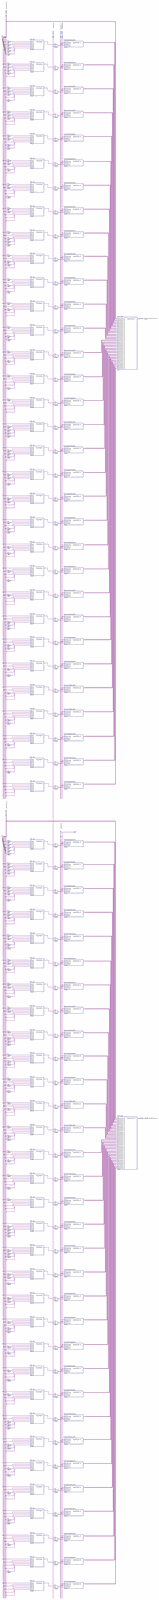
[diagram p0: schematic sheet, whole]
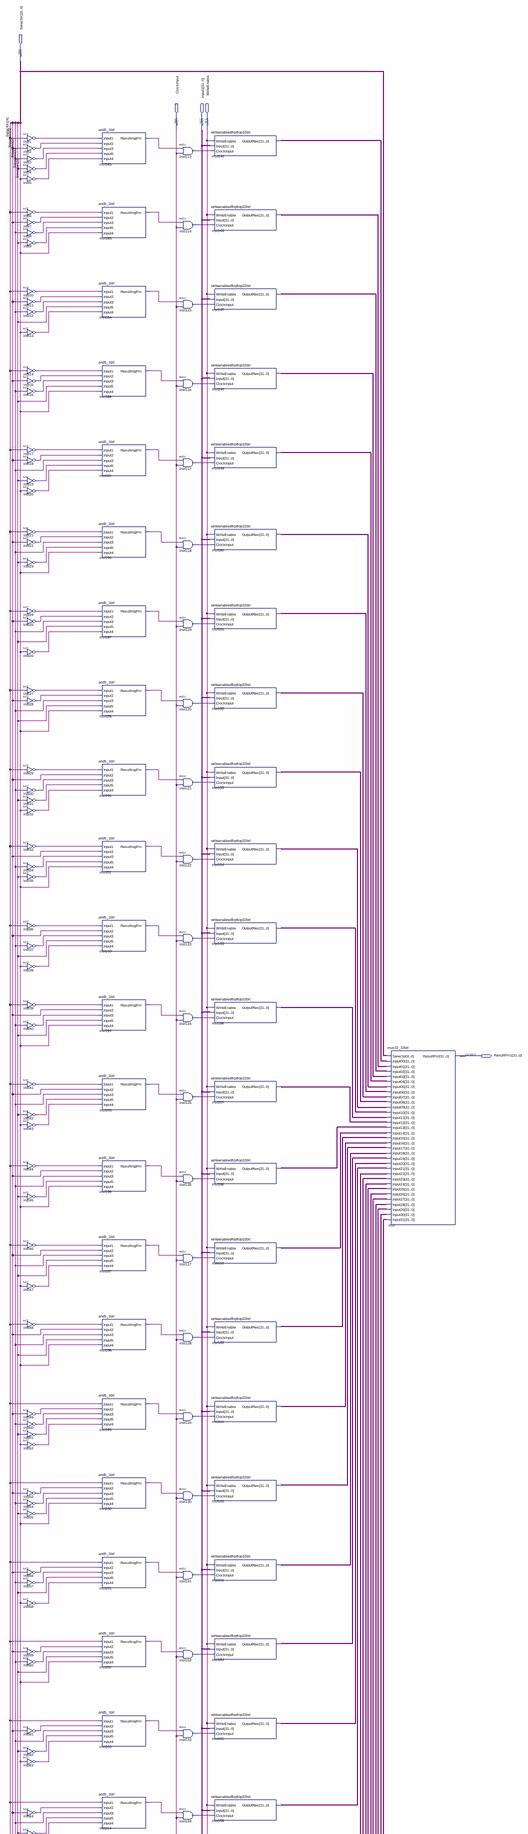
[diagram p1: schematic sheet, upper part]
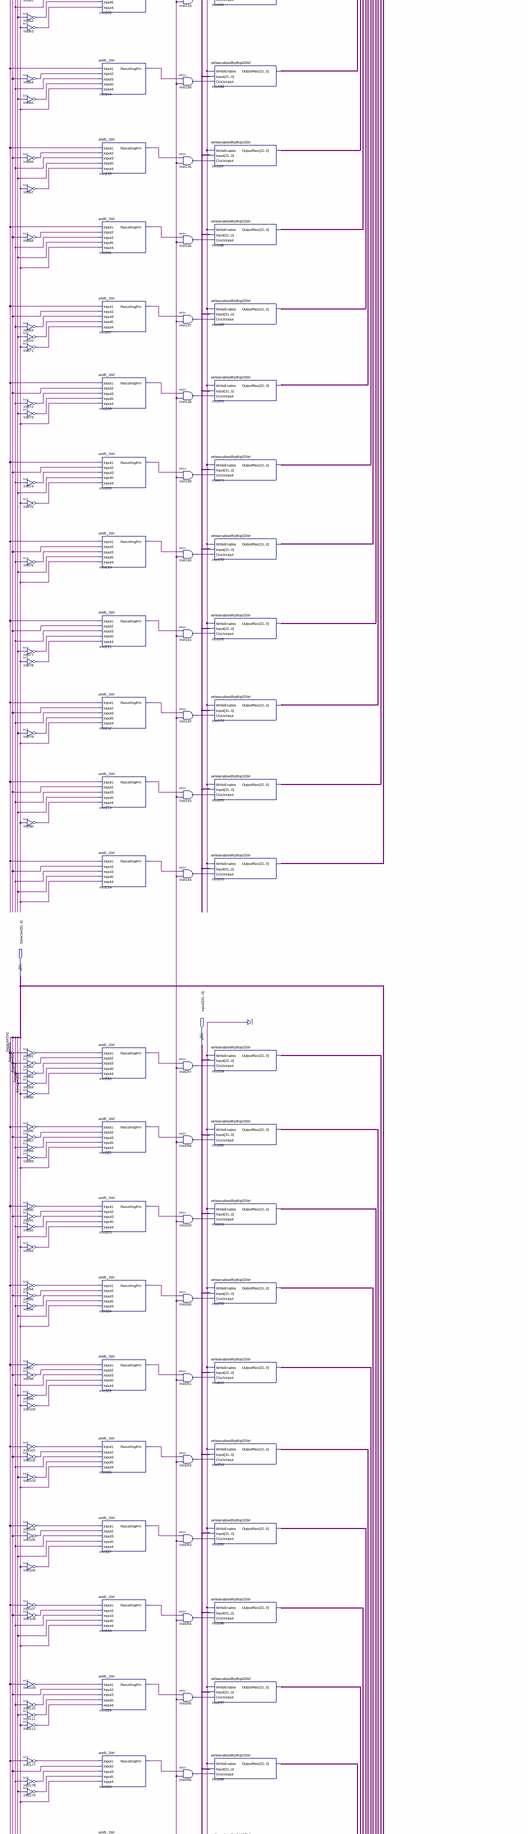
[diagram p2: schematic sheet, middle part]
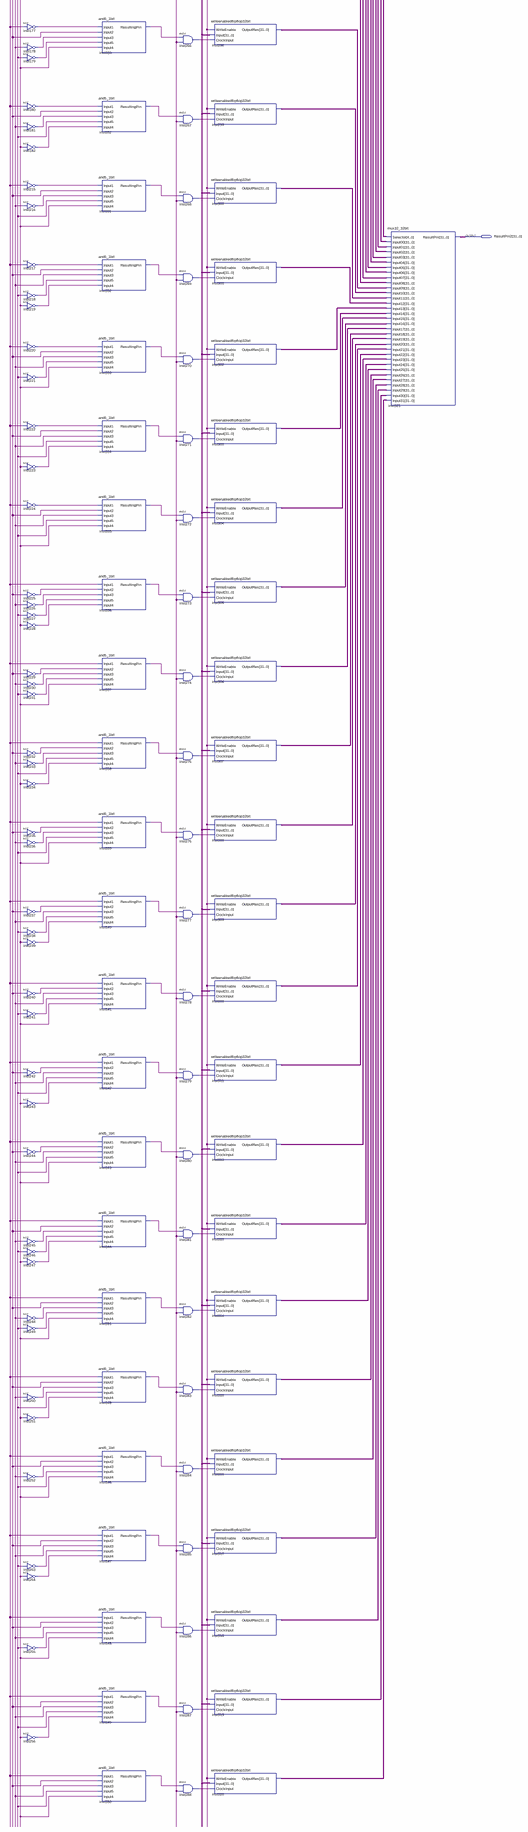
[diagram p3: schematic sheet, lower part]
// Quartus schematic 32writeenabledflipflop32bit2input.bdf as structural Verilog: 354 symbols, 8 pins
module \32writeenabledflipflop32bit2input  (
  input  [0:4] Selector1,
  input  ClockInput,
  input  [31:0] Input1,
  input  WriteEnable,
  input  [0:4] Selector2,
  input  [31:0] Input2,
  output [31:0] ResultPin1,
  output [31:0] ResultPin2
);

  wire inst1_out, inst2_out, inst3_out, inst4_out, inst5_out, inst6_out, inst7_out, inst8_out, inst9_out,
       inst10_out, inst11_out, inst12_out, inst13_out, inst14_out, inst15_out, inst16_out, inst17_out,
       inst18_out, inst19_out, inst20_out, inst21_out, inst22_out, inst23_out, inst24_out, inst25_out,
       inst26_out, inst27_out, inst28_out, inst29_out, inst30_out, inst31_out, inst32_out, inst33_out,
       inst34_out, inst35_out, inst36_out, inst37_out, inst38_out, inst39_out, inst40_out, inst41_out,
       inst42_out, inst43_out, inst44_out, inst45_out, inst46_out, inst47_out, inst48_out, inst49_out,
       inst50_out, inst51_out, inst52_out, inst53_out, inst54_out, inst55_out, inst56_out, inst57_out,
       inst58_out, inst59_out, inst60_out, inst61_out, inst62_out, inst63_out, inst64_out, inst65_out,
       inst66_out, inst67_out, inst68_out, inst69_out, inst70_out, inst71_out, inst72_out, inst73_out,
       inst74_out, inst75_out, inst76_out, inst77_out, inst78_out, inst79_out, inst80_out, inst81_out,
       inst82_out, inst83_out, inst84_out, inst85_out, inst86_out, inst87_out, inst88_out, inst89_out,
       inst90_out, inst91_out, inst92_out, inst93_out, inst94_out, inst95_out, inst96_out, inst97_out,
       inst98_out, inst99_out, inst100_out, inst101_out, inst102_out, inst103_out, inst104_out, inst105_out,
       inst106_out, inst107_out, inst108_out, inst109_out, inst110_out, inst111_out, inst112_out,
       inst113_out, inst114_out, inst115_out, inst116_out, inst117_out, inst118_out, inst119_out,
       inst120_out, inst121_out, inst122_out, inst123_out, inst124_out, inst125_out, inst126_out,
       inst127_out, inst128_out, inst129_out, inst130_out, inst131_out, inst132_out, inst133_out,
       inst134_out, inst135_out, inst136_out, inst137_out, inst138_out, inst139_out, inst140_out,
       inst141_out, inst142_out, inst143_out, inst144_out, inst177_out, inst178_out, inst179_out,
       inst180_out, inst181_out, inst182_out, inst183_resultingpin, inst184_resultingpin,
       inst185_resultingpin, inst186_resultingpin, inst187_resultingpin, inst188_resultingpin,
       inst189_resultingpin, inst190_resultingpin, inst191_resultingpin, inst192_resultingpin,
       inst193_resultingpin, inst194_resultingpin, inst195_resultingpin, inst196_resultingpin,
       inst197_resultingpin, inst198_resultingpin, inst199_resultingpin, inst200_resultingpin,
       inst201_resultingpin, inst202_resultingpin, inst203_resultingpin, inst204_resultingpin,
       inst205_resultingpin, inst206_resultingpin, inst207_resultingpin, inst208_resultingpin,
       inst209_resultingpin, inst210_resultingpin, inst211_resultingpin, inst212_resultingpin,
       inst213_resultingpin, inst214_resultingpin, inst215_out, inst216_out, inst217_out, inst218_out,
       inst219_out, inst220_out, inst221_out, inst222_out, inst223_out, inst224_out, inst225_out,
       inst226_out, inst227_out, inst228_out, inst229_out, inst230_out, inst231_out, inst232_out,
       inst233_out, inst234_out, inst235_out, inst236_out, inst237_out, inst238_out, inst239_out,
       inst240_out, inst241_out, inst242_out, inst243_out, inst244_out, inst245_out, inst246_out,
       inst247_out, inst248_out, inst249_out, inst250_out, inst251_out, inst252_out, inst253_out,
       inst254_out, inst255_out, inst256_out, inst257_out, inst258_out, inst259_out, inst260_out,
       inst261_out, inst262_out, inst263_out, inst264_out, inst265_out, inst266_out, inst267_out,
       inst268_out, inst269_out, inst270_out, inst271_out, inst272_out, inst273_out, inst274_out,
       inst275_out, inst276_out, inst277_out, inst278_out, inst279_out, inst280_out, inst281_out,
       inst282_out, inst283_out, inst284_out, inst285_out, inst286_out, inst287_out, inst288_out,
       inst322_resultingpin, inst323_resultingpin, inst324_resultingpin, inst325_resultingpin,
       inst326_resultingpin, inst327_resultingpin, inst328_resultingpin, inst329_resultingpin,
       inst330_resultingpin, inst331_resultingpin, inst332_resultingpin, inst333_resultingpin,
       inst334_resultingpin, inst335_resultingpin, inst336_resultingpin, inst337_resultingpin,
       inst338_resultingpin, inst339_resultingpin, inst340_resultingpin, inst341_resultingpin,
       inst342_resultingpin, inst343_resultingpin, inst344_resultingpin, inst345_resultingpin,
       inst346_resultingpin, inst347_resultingpin, inst348_resultingpin, inst349_resultingpin,
       inst350_resultingpin, inst351_resultingpin, inst352_resultingpin, inst353_resultingpin;
  wire [31:0] inst145_outputres, inst146_outputres, inst147_outputres, inst148_outputres, inst149_outputres,
       inst150_outputres, inst151_outputres, inst152_outputres, inst153_outputres, inst154_outputres,
       inst155_outputres, inst156_outputres, inst157_outputres, inst158_outputres, inst159_outputres,
       inst160_outputres, inst161_outputres, inst162_outputres, inst163_outputres, inst164_outputres,
       inst165_outputres, inst166_outputres, inst167_outputres, inst168_outputres, inst169_outputres,
       inst170_outputres, inst171_outputres, inst172_outputres, inst173_outputres, inst174_outputres,
       inst175_outputres, inst176_outputres, inst289_outputres, inst290_outputres, inst291_outputres,
       inst292_outputres, inst293_outputres, inst294_outputres, inst295_outputres, inst296_outputres,
       inst297_outputres, inst298_outputres, inst299_outputres, inst300_outputres, inst301_outputres,
       inst302_outputres, inst303_outputres, inst304_outputres, inst305_outputres, inst306_outputres,
       inst307_outputres, inst308_outputres, inst309_outputres, inst310_outputres, inst311_outputres,
       inst312_outputres, inst313_outputres, inst314_outputres, inst315_outputres, inst316_outputres,
       inst317_outputres, inst318_outputres, inst319_outputres, inst320_outputres;

  not inst1 (inst1_out, Selector1[4]);
  not inst2 (inst2_out, Selector1[3]);
  not inst3 (inst3_out, Selector1[2]);
  not inst4 (inst4_out, Selector1[1]);
  not inst5 (inst5_out, Selector1[0]);
  not inst6 (inst6_out, Selector1[4]);
  not inst7 (inst7_out, Selector1[3]);
  not inst8 (inst8_out, Selector1[2]);
  not inst9 (inst9_out, Selector1[1]);
  not inst10 (inst10_out, Selector1[4]);
  not inst11 (inst11_out, Selector1[3]);
  not inst12 (inst12_out, Selector1[2]);
  not inst13 (inst13_out, Selector1[0]);
  not inst14 (inst14_out, Selector1[4]);
  not inst15 (inst15_out, Selector1[3]);
  not inst16 (inst16_out, Selector1[2]);
  not inst17 (inst17_out, Selector1[4]);
  not inst18 (inst18_out, Selector1[3]);
  not inst19 (inst19_out, Selector1[1]);
  not inst20 (inst20_out, Selector1[0]);
  not inst21 (inst21_out, Selector1[4]);
  not inst22 (inst22_out, Selector1[3]);
  not inst23 (inst23_out, Selector1[1]);
  not inst24 (inst24_out, Selector1[4]);
  not inst25 (inst25_out, Selector1[3]);
  not inst26 (inst26_out, Selector1[0]);
  not inst27 (inst27_out, Selector1[4]);
  not inst28 (inst28_out, Selector1[3]);
  not inst29 (inst29_out, Selector1[4]);
  not inst30 (inst30_out, Selector1[2]);
  not inst31 (inst31_out, Selector1[1]);
  not inst32 (inst32_out, Selector1[0]);
  not inst33 (inst33_out, Selector1[4]);
  not inst34 (inst34_out, Selector1[2]);
  not inst35 (inst35_out, Selector1[1]);
  not inst36 (inst36_out, Selector1[4]);
  not inst37 (inst37_out, Selector1[2]);
  not inst38 (inst38_out, Selector1[0]);
  not inst39 (inst39_out, Selector1[4]);
  not inst40 (inst40_out, Selector1[2]);
  not inst41 (inst41_out, Selector1[4]);
  not inst42 (inst42_out, Selector1[1]);
  not inst43 (inst43_out, Selector1[0]);
  not inst44 (inst44_out, Selector1[4]);
  not inst45 (inst45_out, Selector1[1]);
  not inst46 (inst46_out, Selector1[4]);
  not inst47 (inst47_out, Selector1[0]);
  not inst48 (inst48_out, Selector1[4]);
  not inst49 (inst49_out, Selector1[3]);
  not inst50 (inst50_out, Selector1[2]);
  not inst51 (inst51_out, Selector1[1]);
  not inst52 (inst52_out, Selector1[0]);
  not inst53 (inst53_out, Selector1[3]);
  not inst54 (inst54_out, Selector1[2]);
  not inst55 (inst55_out, Selector1[1]);
  not inst56 (inst56_out, Selector1[3]);
  not inst57 (inst57_out, Selector1[2]);
  not inst58 (inst58_out, Selector1[0]);
  not inst59 (inst59_out, Selector1[3]);
  not inst60 (inst60_out, Selector1[2]);
  not inst61 (inst61_out, Selector1[3]);
  not inst62 (inst62_out, Selector1[1]);
  not inst63 (inst63_out, Selector1[0]);
  not inst64 (inst64_out, Selector1[3]);
  not inst65 (inst65_out, Selector1[1]);
  not inst66 (inst66_out, Selector1[3]);
  not inst67 (inst67_out, Selector1[0]);
  not inst68 (inst68_out, Selector1[3]);
  not inst69 (inst69_out, Selector1[2]);
  not inst70 (inst70_out, Selector1[1]);
  not inst71 (inst71_out, Selector1[0]);
  not inst72 (inst72_out, Selector1[2]);
  not inst73 (inst73_out, Selector1[1]);
  not inst74 (inst74_out, Selector1[2]);
  not inst75 (inst75_out, Selector1[0]);
  not inst76 (inst76_out, Selector1[2]);
  not inst77 (inst77_out, Selector1[1]);
  not inst78 (inst78_out, Selector1[0]);
  not inst79 (inst79_out, Selector1[1]);
  not inst80 (inst80_out, Selector1[0]);
  not inst81 (inst81_out, Selector2[4]);
  not inst82 (inst82_out, Selector2[3]);
  not inst83 (inst83_out, Selector2[2]);
  not inst84 (inst84_out, Selector2[1]);
  not inst85 (inst85_out, Selector2[0]);
  not inst86 (inst86_out, Selector2[4]);
  not inst87 (inst87_out, Selector2[3]);
  not inst88 (inst88_out, Selector2[2]);
  not inst89 (inst89_out, Selector2[1]);
  not inst90 (inst90_out, Selector2[4]);
  not inst91 (inst91_out, Selector2[3]);
  not inst92 (inst92_out, Selector2[2]);
  not inst93 (inst93_out, Selector2[0]);
  not inst94 (inst94_out, Selector2[4]);
  not inst95 (inst95_out, Selector2[3]);
  not inst96 (inst96_out, Selector2[2]);
  not inst97 (inst97_out, Selector2[4]);
  not inst98 (inst98_out, Selector2[3]);
  not inst99 (inst99_out, Selector2[1]);
  not inst100 (inst100_out, Selector2[0]);
  not inst101 (inst101_out, Selector2[4]);
  not inst102 (inst102_out, Selector2[3]);
  not inst103 (inst103_out, Selector2[1]);
  not inst104 (inst104_out, Selector2[4]);
  not inst105 (inst105_out, Selector2[3]);
  not inst106 (inst106_out, Selector2[0]);
  not inst107 (inst107_out, Selector2[4]);
  not inst108 (inst108_out, Selector2[3]);
  not inst109 (inst109_out, Selector2[4]);
  not inst110 (inst110_out, Selector2[2]);
  not inst111 (inst111_out, Selector2[1]);
  not inst112 (inst112_out, Selector2[0]);
  not inst177 (inst177_out, Selector2[4]);
  not inst178 (inst178_out, Selector2[2]);
  not inst179 (inst179_out, Selector2[1]);
  not inst180 (inst180_out, Selector2[4]);
  not inst181 (inst181_out, Selector2[2]);
  not inst182 (inst182_out, Selector2[0]);
  not inst215 (inst215_out, Selector2[4]);
  not inst216 (inst216_out, Selector2[2]);
  not inst217 (inst217_out, Selector2[4]);
  not inst218 (inst218_out, Selector2[1]);
  not inst219 (inst219_out, Selector2[0]);
  not inst220 (inst220_out, Selector2[4]);
  not inst221 (inst221_out, Selector2[1]);
  not inst222 (inst222_out, Selector2[4]);
  not inst223 (inst223_out, Selector2[0]);
  not inst224 (inst224_out, Selector2[4]);
  not inst225 (inst225_out, Selector2[3]);
  not inst226 (inst226_out, Selector2[2]);
  not inst227 (inst227_out, Selector2[1]);
  not inst228 (inst228_out, Selector2[0]);
  not inst229 (inst229_out, Selector2[3]);
  not inst230 (inst230_out, Selector2[2]);
  not inst231 (inst231_out, Selector2[1]);
  not inst232 (inst232_out, Selector2[3]);
  not inst233 (inst233_out, Selector2[2]);
  not inst234 (inst234_out, Selector2[0]);
  not inst235 (inst235_out, Selector2[3]);
  not inst236 (inst236_out, Selector2[2]);
  not inst237 (inst237_out, Selector2[3]);
  not inst238 (inst238_out, Selector2[1]);
  not inst239 (inst239_out, Selector2[0]);
  not inst240 (inst240_out, Selector2[3]);
  not inst241 (inst241_out, Selector2[1]);
  not inst242 (inst242_out, Selector2[3]);
  not inst243 (inst243_out, Selector2[0]);
  not inst244 (inst244_out, Selector2[3]);
  not inst245 (inst245_out, Selector2[2]);
  not inst246 (inst246_out, Selector2[1]);
  not inst247 (inst247_out, Selector2[0]);
  not inst248 (inst248_out, Selector2[2]);
  not inst249 (inst249_out, Selector2[1]);
  not inst250 (inst250_out, Selector2[2]);
  not inst251 (inst251_out, Selector2[0]);
  not inst252 (inst252_out, Selector2[2]);
  not inst253 (inst253_out, Selector2[1]);
  not inst254 (inst254_out, Selector2[0]);
  not inst255 (inst255_out, Selector2[1]);
  not inst256 (inst256_out, Selector2[0]);
  and5_1bit inst185 (
    .Input1(inst1_out), .Input2(inst2_out), .Input3(inst3_out), .Input5(inst4_out), .Input4(inst5_out),
    .ResultingPin(inst185_resultingpin));
  and5_1bit inst183 (
    .Input1(inst6_out), .Input2(inst7_out), .Input3(inst8_out), .Input5(inst9_out), .Input4(Selector1[0]),
    .ResultingPin(inst183_resultingpin));
  and5_1bit inst184 (
    .Input1(inst10_out), .Input2(inst11_out), .Input3(inst12_out), .Input5(Selector1[1]),
    .Input4(inst13_out), .ResultingPin(inst184_resultingpin));
  and5_1bit inst186 (
    .Input1(inst14_out), .Input2(inst15_out), .Input3(inst16_out), .Input5(Selector1[1]),
    .Input4(Selector1[0]), .ResultingPin(inst186_resultingpin));
  and5_1bit inst189 (
    .Input1(inst17_out), .Input2(inst18_out), .Input3(Selector1[2]), .Input5(inst19_out),
    .Input4(inst20_out), .ResultingPin(inst189_resultingpin));
  and5_1bit inst190 (
    .Input1(inst21_out), .Input2(inst22_out), .Input3(Selector1[2]), .Input5(inst23_out),
    .Input4(Selector1[0]), .ResultingPin(inst190_resultingpin));
  and5_1bit inst187 (
    .Input1(inst24_out), .Input2(inst25_out), .Input3(Selector1[2]), .Input5(Selector1[1]),
    .Input4(inst26_out), .ResultingPin(inst187_resultingpin));
  and5_1bit inst188 (
    .Input1(inst27_out), .Input2(inst28_out), .Input3(Selector1[2]), .Input5(Selector1[1]),
    .Input4(Selector1[0]), .ResultingPin(inst188_resultingpin));
  and5_1bit inst191 (
    .Input1(inst29_out), .Input2(Selector1[3]), .Input3(inst30_out), .Input5(inst31_out),
    .Input4(inst32_out), .ResultingPin(inst191_resultingpin));
  and5_1bit inst192 (
    .Input1(inst33_out), .Input2(Selector1[3]), .Input3(inst34_out), .Input5(inst35_out),
    .Input4(Selector1[0]), .ResultingPin(inst192_resultingpin));
  and5_1bit inst193 (
    .Input1(inst36_out), .Input2(Selector1[3]), .Input3(inst37_out), .Input5(Selector1[1]),
    .Input4(inst38_out), .ResultingPin(inst193_resultingpin));
  and5_1bit inst194 (
    .Input1(inst39_out), .Input2(Selector1[3]), .Input3(inst40_out), .Input5(Selector1[1]),
    .Input4(Selector1[0]), .ResultingPin(inst194_resultingpin));
  and5_1bit inst195 (
    .Input1(inst41_out), .Input2(Selector1[3]), .Input3(Selector1[2]), .Input5(inst42_out),
    .Input4(inst43_out), .ResultingPin(inst195_resultingpin));
  and5_1bit inst196 (
    .Input1(inst44_out), .Input2(Selector1[3]), .Input3(Selector1[2]), .Input5(inst45_out),
    .Input4(Selector1[0]), .ResultingPin(inst196_resultingpin));
  and5_1bit inst197 (
    .Input1(inst46_out), .Input2(Selector1[3]), .Input3(Selector1[2]), .Input5(Selector1[1]),
    .Input4(inst47_out), .ResultingPin(inst197_resultingpin));
  and5_1bit inst198 (
    .Input1(inst48_out), .Input2(Selector1[3]), .Input3(Selector1[2]), .Input5(Selector1[1]),
    .Input4(Selector1[0]), .ResultingPin(inst198_resultingpin));
  and5_1bit inst199 (
    .Input1(Selector1[4]), .Input2(inst49_out), .Input3(inst50_out), .Input5(inst51_out),
    .Input4(inst52_out), .ResultingPin(inst199_resultingpin));
  and5_1bit inst200 (
    .Input1(Selector1[4]), .Input2(inst53_out), .Input3(inst54_out), .Input5(inst55_out),
    .Input4(Selector1[0]), .ResultingPin(inst200_resultingpin));
  and5_1bit inst201 (
    .Input1(Selector1[4]), .Input2(inst56_out), .Input3(inst57_out), .Input5(Selector1[1]),
    .Input4(inst58_out), .ResultingPin(inst201_resultingpin));
  and5_1bit inst202 (
    .Input1(Selector1[4]), .Input2(inst59_out), .Input3(inst60_out), .Input5(Selector1[1]),
    .Input4(Selector1[0]), .ResultingPin(inst202_resultingpin));
  and5_1bit inst203 (
    .Input1(Selector1[4]), .Input2(inst61_out), .Input3(Selector1[2]), .Input5(inst62_out),
    .Input4(inst63_out), .ResultingPin(inst203_resultingpin));
  and5_1bit inst204 (
    .Input1(Selector1[4]), .Input2(inst64_out), .Input3(Selector1[2]), .Input5(inst65_out),
    .Input4(Selector1[0]), .ResultingPin(inst204_resultingpin));
  and5_1bit inst205 (
    .Input1(Selector1[4]), .Input2(inst66_out), .Input3(Selector1[2]), .Input5(Selector1[1]),
    .Input4(inst67_out), .ResultingPin(inst205_resultingpin));
  and5_1bit inst206 (
    .Input1(Selector1[4]), .Input2(inst68_out), .Input3(Selector1[2]), .Input5(Selector1[1]),
    .Input4(Selector1[0]), .ResultingPin(inst206_resultingpin));
  and5_1bit inst207 (
    .Input1(Selector1[4]), .Input2(Selector1[3]), .Input3(inst69_out), .Input5(inst70_out),
    .Input4(inst71_out), .ResultingPin(inst207_resultingpin));
  and5_1bit inst208 (
    .Input1(Selector1[4]), .Input2(Selector1[3]), .Input3(inst72_out), .Input5(inst73_out),
    .Input4(Selector1[0]), .ResultingPin(inst208_resultingpin));
  and5_1bit inst209 (
    .Input1(Selector1[4]), .Input2(Selector1[3]), .Input3(inst74_out), .Input5(Selector1[1]),
    .Input4(inst75_out), .ResultingPin(inst209_resultingpin));
  and5_1bit inst210 (
    .Input1(Selector1[4]), .Input2(Selector1[3]), .Input3(inst76_out), .Input5(Selector1[1]),
    .Input4(Selector1[0]), .ResultingPin(inst210_resultingpin));
  and5_1bit inst211 (
    .Input1(Selector1[4]), .Input2(Selector1[3]), .Input3(Selector1[2]), .Input5(inst77_out),
    .Input4(inst78_out), .ResultingPin(inst211_resultingpin));
  and5_1bit inst212 (
    .Input1(Selector1[4]), .Input2(Selector1[3]), .Input3(Selector1[2]), .Input5(inst79_out),
    .Input4(Selector1[0]), .ResultingPin(inst212_resultingpin));
  and5_1bit inst213 (
    .Input1(Selector1[4]), .Input2(Selector1[3]), .Input3(Selector1[2]), .Input5(Selector1[1]),
    .Input4(inst80_out), .ResultingPin(inst213_resultingpin));
  and5_1bit inst214 (
    .Input1(Selector1[4]), .Input2(Selector1[3]), .Input3(Selector1[2]), .Input5(Selector1[1]),
    .Input4(Selector1[0]), .ResultingPin(inst214_resultingpin));
  and5_1bit inst353 (
    .Input1(inst81_out), .Input2(inst82_out), .Input3(inst83_out), .Input5(inst84_out), .Input4(inst85_out),
    .ResultingPin(inst353_resultingpin));
  and5_1bit inst322 (
    .Input1(inst86_out), .Input2(inst87_out), .Input3(inst88_out), .Input5(inst89_out),
    .Input4(Selector2[0]), .ResultingPin(inst322_resultingpin));
  and5_1bit inst323 (
    .Input1(inst90_out), .Input2(inst91_out), .Input3(inst92_out), .Input5(Selector2[1]),
    .Input4(inst93_out), .ResultingPin(inst323_resultingpin));
  and5_1bit inst324 (
    .Input1(inst94_out), .Input2(inst95_out), .Input3(inst96_out), .Input5(Selector2[1]),
    .Input4(Selector2[0]), .ResultingPin(inst324_resultingpin));
  and5_1bit inst325 (
    .Input1(inst97_out), .Input2(inst98_out), .Input3(Selector2[2]), .Input5(inst99_out),
    .Input4(inst100_out), .ResultingPin(inst325_resultingpin));
  and5_1bit inst326 (
    .Input1(inst101_out), .Input2(inst102_out), .Input3(Selector2[2]), .Input5(inst103_out),
    .Input4(Selector2[0]), .ResultingPin(inst326_resultingpin));
  and5_1bit inst327 (
    .Input1(inst104_out), .Input2(inst105_out), .Input3(Selector2[2]), .Input5(Selector2[1]),
    .Input4(inst106_out), .ResultingPin(inst327_resultingpin));
  and5_1bit inst328 (
    .Input1(inst107_out), .Input2(inst108_out), .Input3(Selector2[2]), .Input5(Selector2[1]),
    .Input4(Selector2[0]), .ResultingPin(inst328_resultingpin));
  and5_1bit inst329 (
    .Input1(inst109_out), .Input2(Selector2[3]), .Input3(inst110_out), .Input5(inst111_out),
    .Input4(inst112_out), .ResultingPin(inst329_resultingpin));
  and5_1bit inst330 (
    .Input1(inst177_out), .Input2(Selector2[3]), .Input3(inst178_out), .Input5(inst179_out),
    .Input4(Selector2[0]), .ResultingPin(inst330_resultingpin));
  and5_1bit inst352 (
    .Input1(inst180_out), .Input2(Selector2[3]), .Input3(inst181_out), .Input5(Selector2[1]),
    .Input4(inst182_out), .ResultingPin(inst352_resultingpin));
  and5_1bit inst331 (
    .Input1(inst215_out), .Input2(Selector2[3]), .Input3(inst216_out), .Input5(Selector2[1]),
    .Input4(Selector2[0]), .ResultingPin(inst331_resultingpin));
  and5_1bit inst332 (
    .Input1(inst217_out), .Input2(Selector2[3]), .Input3(Selector2[2]), .Input5(inst218_out),
    .Input4(inst219_out), .ResultingPin(inst332_resultingpin));
  and5_1bit inst333 (
    .Input1(inst220_out), .Input2(Selector2[3]), .Input3(Selector2[2]), .Input5(inst221_out),
    .Input4(Selector2[0]), .ResultingPin(inst333_resultingpin));
  and5_1bit inst334 (
    .Input1(inst222_out), .Input2(Selector2[3]), .Input3(Selector2[2]), .Input5(Selector2[1]),
    .Input4(inst223_out), .ResultingPin(inst334_resultingpin));
  and5_1bit inst335 (
    .Input1(inst224_out), .Input2(Selector2[3]), .Input3(Selector2[2]), .Input5(Selector2[1]),
    .Input4(Selector2[0]), .ResultingPin(inst335_resultingpin));
  and5_1bit inst336 (
    .Input1(Selector2[4]), .Input2(inst225_out), .Input3(inst226_out), .Input5(inst227_out),
    .Input4(inst228_out), .ResultingPin(inst336_resultingpin));
  and5_1bit inst337 (
    .Input1(Selector2[4]), .Input2(inst229_out), .Input3(inst230_out), .Input5(inst231_out),
    .Input4(Selector2[0]), .ResultingPin(inst337_resultingpin));
  and5_1bit inst338 (
    .Input1(Selector2[4]), .Input2(inst232_out), .Input3(inst233_out), .Input5(Selector2[1]),
    .Input4(inst234_out), .ResultingPin(inst338_resultingpin));
  and5_1bit inst339 (
    .Input1(Selector2[4]), .Input2(inst235_out), .Input3(inst236_out), .Input5(Selector2[1]),
    .Input4(Selector2[0]), .ResultingPin(inst339_resultingpin));
  and5_1bit inst340 (
    .Input1(Selector2[4]), .Input2(inst237_out), .Input3(Selector2[2]), .Input5(inst238_out),
    .Input4(inst239_out), .ResultingPin(inst340_resultingpin));
  and5_1bit inst341 (
    .Input1(Selector2[4]), .Input2(inst240_out), .Input3(Selector2[2]), .Input5(inst241_out),
    .Input4(Selector2[0]), .ResultingPin(inst341_resultingpin));
  and5_1bit inst342 (
    .Input1(Selector2[4]), .Input2(inst242_out), .Input3(Selector2[2]), .Input5(Selector2[1]),
    .Input4(inst243_out), .ResultingPin(inst342_resultingpin));
  and5_1bit inst343 (
    .Input1(Selector2[4]), .Input2(inst244_out), .Input3(Selector2[2]), .Input5(Selector2[1]),
    .Input4(Selector2[0]), .ResultingPin(inst343_resultingpin));
  and5_1bit inst344 (
    .Input1(Selector2[4]), .Input2(Selector2[3]), .Input3(inst245_out), .Input5(inst246_out),
    .Input4(inst247_out), .ResultingPin(inst344_resultingpin));
  and5_1bit inst351 (
    .Input1(Selector2[4]), .Input2(Selector2[3]), .Input3(inst248_out), .Input5(inst249_out),
    .Input4(Selector2[0]), .ResultingPin(inst351_resultingpin));
  and5_1bit inst345 (
    .Input1(Selector2[4]), .Input2(Selector2[3]), .Input3(inst250_out), .Input5(Selector2[1]),
    .Input4(inst251_out), .ResultingPin(inst345_resultingpin));
  and5_1bit inst346 (
    .Input1(Selector2[4]), .Input2(Selector2[3]), .Input3(inst252_out), .Input5(Selector2[1]),
    .Input4(Selector2[0]), .ResultingPin(inst346_resultingpin));
  and5_1bit inst347 (
    .Input1(Selector2[4]), .Input2(Selector2[3]), .Input3(Selector2[2]), .Input5(inst253_out),
    .Input4(inst254_out), .ResultingPin(inst347_resultingpin));
  and5_1bit inst348 (
    .Input1(Selector2[4]), .Input2(Selector2[3]), .Input3(Selector2[2]), .Input5(inst255_out),
    .Input4(Selector2[0]), .ResultingPin(inst348_resultingpin));
  and5_1bit inst349 (
    .Input1(Selector2[4]), .Input2(Selector2[3]), .Input3(Selector2[2]), .Input5(Selector2[1]),
    .Input4(inst256_out), .ResultingPin(inst349_resultingpin));
  and5_1bit inst350 (
    .Input1(Selector2[4]), .Input2(Selector2[3]), .Input3(Selector2[2]), .Input5(Selector2[1]),
    .Input4(Selector2[0]), .ResultingPin(inst350_resultingpin));
  and inst113 (inst113_out, inst185_resultingpin, ClockInput);
  and inst114 (inst114_out, inst183_resultingpin, ClockInput);
  and inst115 (inst115_out, inst184_resultingpin, ClockInput);
  and inst116 (inst116_out, inst186_resultingpin, ClockInput);
  and inst117 (inst117_out, inst189_resultingpin, ClockInput);
  and inst118 (inst118_out, inst190_resultingpin, ClockInput);
  and inst119 (inst119_out, inst187_resultingpin, ClockInput);
  and inst120 (inst120_out, inst188_resultingpin, ClockInput);
  and inst121 (inst121_out, inst191_resultingpin, ClockInput);
  and inst122 (inst122_out, inst192_resultingpin, ClockInput);
  and inst123 (inst123_out, inst193_resultingpin, ClockInput);
  and inst124 (inst124_out, inst194_resultingpin, ClockInput);
  and inst125 (inst125_out, inst195_resultingpin, ClockInput);
  and inst126 (inst126_out, inst196_resultingpin, ClockInput);
  and inst127 (inst127_out, inst197_resultingpin, ClockInput);
  and inst128 (inst128_out, inst198_resultingpin, ClockInput);
  and inst129 (inst129_out, inst199_resultingpin, ClockInput);
  and inst130 (inst130_out, inst200_resultingpin, ClockInput);
  and inst131 (inst131_out, inst201_resultingpin, ClockInput);
  and inst132 (inst132_out, inst202_resultingpin, ClockInput);
  and inst133 (inst133_out, inst203_resultingpin, ClockInput);
  and inst134 (inst134_out, inst204_resultingpin, ClockInput);
  and inst135 (inst135_out, inst205_resultingpin, ClockInput);
  and inst136 (inst136_out, inst206_resultingpin, ClockInput);
  and inst137 (inst137_out, inst207_resultingpin, ClockInput);
  and inst138 (inst138_out, inst208_resultingpin, ClockInput);
  and inst139 (inst139_out, inst209_resultingpin, ClockInput);
  and inst140 (inst140_out, inst210_resultingpin, ClockInput);
  and inst141 (inst141_out, inst211_resultingpin, ClockInput);
  and inst142 (inst142_out, inst212_resultingpin, ClockInput);
  and inst143 (inst143_out, inst213_resultingpin, ClockInput);
  and inst144 (inst144_out, inst214_resultingpin, ClockInput);
  and inst257 (inst257_out, inst353_resultingpin, ClockInput);
  and inst258 (inst258_out, inst322_resultingpin, ClockInput);
  and inst259 (inst259_out, inst323_resultingpin, ClockInput);
  and inst260 (inst260_out, inst324_resultingpin, ClockInput);
  and inst261 (inst261_out, inst325_resultingpin, ClockInput);
  and inst262 (inst262_out, inst326_resultingpin, ClockInput);
  and inst263 (inst263_out, inst327_resultingpin, ClockInput);
  and inst264 (inst264_out, inst328_resultingpin, ClockInput);
  and inst265 (inst265_out, inst329_resultingpin, ClockInput);
  and inst266 (inst266_out, inst330_resultingpin, ClockInput);
  and inst267 (inst267_out, inst352_resultingpin, ClockInput);
  and inst268 (inst268_out, inst331_resultingpin, ClockInput);
  and inst269 (inst269_out, inst332_resultingpin, ClockInput);
  and inst270 (inst270_out, inst333_resultingpin, ClockInput);
  and inst271 (inst271_out, inst334_resultingpin, ClockInput);
  and inst272 (inst272_out, inst335_resultingpin, ClockInput);
  and inst273 (inst273_out, inst336_resultingpin, ClockInput);
  and inst274 (inst274_out, inst337_resultingpin, ClockInput);
  and inst275 (inst275_out, inst338_resultingpin, ClockInput);
  and inst276 (inst276_out, inst339_resultingpin, ClockInput);
  and inst277 (inst277_out, inst340_resultingpin, ClockInput);
  and inst278 (inst278_out, inst341_resultingpin, ClockInput);
  and inst279 (inst279_out, inst342_resultingpin, ClockInput);
  and inst280 (inst280_out, inst343_resultingpin, ClockInput);
  and inst281 (inst281_out, inst344_resultingpin, ClockInput);
  and inst282 (inst282_out, inst351_resultingpin, ClockInput);
  and inst283 (inst283_out, inst345_resultingpin, ClockInput);
  and inst284 (inst284_out, inst346_resultingpin, ClockInput);
  and inst285 (inst285_out, inst347_resultingpin, ClockInput);
  and inst286 (inst286_out, inst348_resultingpin, ClockInput);
  and inst287 (inst287_out, inst349_resultingpin, ClockInput);
  and inst288 (inst288_out, inst350_resultingpin, ClockInput);
  writeenabledflipflop32bit inst145 (
    .WriteEnable(WriteEnable), .Input(Input1), .ClockInput(inst113_out), .OutputRes(inst145_outputres));
  writeenabledflipflop32bit inst146 (
    .WriteEnable(WriteEnable), .Input(Input1), .ClockInput(inst114_out), .OutputRes(inst146_outputres));
  writeenabledflipflop32bit inst147 (
    .WriteEnable(WriteEnable), .Input(Input1), .ClockInput(inst115_out), .OutputRes(inst147_outputres));
  writeenabledflipflop32bit inst148 (
    .WriteEnable(WriteEnable), .Input(Input1), .ClockInput(inst116_out), .OutputRes(inst148_outputres));
  writeenabledflipflop32bit inst149 (
    .WriteEnable(WriteEnable), .Input(Input1), .ClockInput(inst117_out), .OutputRes(inst149_outputres));
  writeenabledflipflop32bit inst150 (
    .WriteEnable(WriteEnable), .Input(Input1), .ClockInput(inst118_out), .OutputRes(inst150_outputres));
  writeenabledflipflop32bit inst151 (
    .WriteEnable(WriteEnable), .Input(Input1), .ClockInput(inst119_out), .OutputRes(inst151_outputres));
  writeenabledflipflop32bit inst152 (
    .WriteEnable(WriteEnable), .Input(Input1), .ClockInput(inst120_out), .OutputRes(inst152_outputres));
  writeenabledflipflop32bit inst153 (
    .WriteEnable(WriteEnable), .Input(Input1), .ClockInput(inst121_out), .OutputRes(inst153_outputres));
  writeenabledflipflop32bit inst154 (
    .WriteEnable(WriteEnable), .Input(Input1), .ClockInput(inst122_out), .OutputRes(inst154_outputres));
  writeenabledflipflop32bit inst155 (
    .WriteEnable(WriteEnable), .Input(Input1), .ClockInput(inst123_out), .OutputRes(inst155_outputres));
  writeenabledflipflop32bit inst156 (
    .WriteEnable(WriteEnable), .Input(Input1), .ClockInput(inst124_out), .OutputRes(inst156_outputres));
  writeenabledflipflop32bit inst157 (
    .WriteEnable(WriteEnable), .Input(Input1), .ClockInput(inst125_out), .OutputRes(inst157_outputres));
  writeenabledflipflop32bit inst158 (
    .WriteEnable(WriteEnable), .Input(Input1), .ClockInput(inst126_out), .OutputRes(inst158_outputres));
  writeenabledflipflop32bit inst159 (
    .WriteEnable(WriteEnable), .Input(Input1), .ClockInput(inst127_out), .OutputRes(inst159_outputres));
  writeenabledflipflop32bit inst160 (
    .WriteEnable(WriteEnable), .Input(Input1), .ClockInput(inst128_out), .OutputRes(inst160_outputres));
  writeenabledflipflop32bit inst161 (
    .WriteEnable(WriteEnable), .Input(Input1), .ClockInput(inst129_out), .OutputRes(inst161_outputres));
  writeenabledflipflop32bit inst162 (
    .WriteEnable(WriteEnable), .Input(Input1), .ClockInput(inst130_out), .OutputRes(inst162_outputres));
  writeenabledflipflop32bit inst163 (
    .WriteEnable(WriteEnable), .Input(Input1), .ClockInput(inst131_out), .OutputRes(inst163_outputres));
  writeenabledflipflop32bit inst164 (
    .WriteEnable(WriteEnable), .Input(Input1), .ClockInput(inst132_out), .OutputRes(inst164_outputres));
  writeenabledflipflop32bit inst165 (
    .WriteEnable(WriteEnable), .Input(Input1), .ClockInput(inst133_out), .OutputRes(inst165_outputres));
  writeenabledflipflop32bit inst166 (
    .WriteEnable(WriteEnable), .Input(Input1), .ClockInput(inst134_out), .OutputRes(inst166_outputres));
  writeenabledflipflop32bit inst167 (
    .WriteEnable(WriteEnable), .Input(Input1), .ClockInput(inst135_out), .OutputRes(inst167_outputres));
  writeenabledflipflop32bit inst168 (
    .WriteEnable(WriteEnable), .Input(Input1), .ClockInput(inst136_out), .OutputRes(inst168_outputres));
  writeenabledflipflop32bit inst169 (
    .WriteEnable(WriteEnable), .Input(Input1), .ClockInput(inst137_out), .OutputRes(inst169_outputres));
  writeenabledflipflop32bit inst170 (
    .WriteEnable(WriteEnable), .Input(Input1), .ClockInput(inst138_out), .OutputRes(inst170_outputres));
  writeenabledflipflop32bit inst171 (
    .WriteEnable(WriteEnable), .Input(Input1), .ClockInput(inst139_out), .OutputRes(inst171_outputres));
  writeenabledflipflop32bit inst172 (
    .WriteEnable(WriteEnable), .Input(Input1), .ClockInput(inst140_out), .OutputRes(inst172_outputres));
  writeenabledflipflop32bit inst173 (
    .WriteEnable(WriteEnable), .Input(Input1), .ClockInput(inst141_out), .OutputRes(inst173_outputres));
  writeenabledflipflop32bit inst174 (
    .WriteEnable(WriteEnable), .Input(Input1), .ClockInput(inst142_out), .OutputRes(inst174_outputres));
  writeenabledflipflop32bit inst175 (
    .WriteEnable(WriteEnable), .Input(Input1), .ClockInput(inst143_out), .OutputRes(inst175_outputres));
  writeenabledflipflop32bit inst176 (
    .WriteEnable(WriteEnable), .Input(Input1), .ClockInput(inst144_out), .OutputRes(inst176_outputres));
  writeenabledflipflop32bit inst289 (
    .WriteEnable(1'b0), .Input(Input2), .ClockInput(inst257_out), .OutputRes(inst289_outputres));
  writeenabledflipflop32bit inst290 (
    .WriteEnable(1'b0), .Input(Input2), .ClockInput(inst258_out), .OutputRes(inst290_outputres));
  writeenabledflipflop32bit inst291 (
    .WriteEnable(1'b0), .Input(Input2), .ClockInput(inst259_out), .OutputRes(inst291_outputres));
  writeenabledflipflop32bit inst292 (
    .WriteEnable(1'b0), .Input(Input2), .ClockInput(inst260_out), .OutputRes(inst292_outputres));
  writeenabledflipflop32bit inst293 (
    .WriteEnable(1'b0), .Input(Input2), .ClockInput(inst261_out), .OutputRes(inst293_outputres));
  writeenabledflipflop32bit inst294 (
    .WriteEnable(1'b0), .Input(Input2), .ClockInput(inst262_out), .OutputRes(inst294_outputres));
  writeenabledflipflop32bit inst295 (
    .WriteEnable(1'b0), .Input(Input2), .ClockInput(inst263_out), .OutputRes(inst295_outputres));
  writeenabledflipflop32bit inst296 (
    .WriteEnable(1'b0), .Input(Input2), .ClockInput(inst264_out), .OutputRes(inst296_outputres));
  writeenabledflipflop32bit inst297 (
    .WriteEnable(1'b0), .Input(Input2), .ClockInput(inst265_out), .OutputRes(inst297_outputres));
  writeenabledflipflop32bit inst298 (
    .WriteEnable(1'b0), .Input(Input2), .ClockInput(inst266_out), .OutputRes(inst298_outputres));
  writeenabledflipflop32bit inst299 (
    .WriteEnable(1'b0), .Input(Input2), .ClockInput(inst267_out), .OutputRes(inst299_outputres));
  writeenabledflipflop32bit inst300 (
    .WriteEnable(1'b0), .Input(Input2), .ClockInput(inst268_out), .OutputRes(inst300_outputres));
  writeenabledflipflop32bit inst301 (
    .WriteEnable(1'b0), .Input(Input2), .ClockInput(inst269_out), .OutputRes(inst301_outputres));
  writeenabledflipflop32bit inst302 (
    .WriteEnable(1'b0), .Input(Input2), .ClockInput(inst270_out), .OutputRes(inst302_outputres));
  writeenabledflipflop32bit inst303 (
    .WriteEnable(1'b0), .Input(Input2), .ClockInput(inst271_out), .OutputRes(inst303_outputres));
  writeenabledflipflop32bit inst304 (
    .WriteEnable(1'b0), .Input(Input2), .ClockInput(inst272_out), .OutputRes(inst304_outputres));
  writeenabledflipflop32bit inst305 (
    .WriteEnable(1'b0), .Input(Input2), .ClockInput(inst273_out), .OutputRes(inst305_outputres));
  writeenabledflipflop32bit inst306 (
    .WriteEnable(1'b0), .Input(Input2), .ClockInput(inst274_out), .OutputRes(inst306_outputres));
  writeenabledflipflop32bit inst307 (
    .WriteEnable(1'b0), .Input(Input2), .ClockInput(inst275_out), .OutputRes(inst307_outputres));
  writeenabledflipflop32bit inst308 (
    .WriteEnable(1'b0), .Input(Input2), .ClockInput(inst276_out), .OutputRes(inst308_outputres));
  writeenabledflipflop32bit inst309 (
    .WriteEnable(1'b0), .Input(Input2), .ClockInput(inst277_out), .OutputRes(inst309_outputres));
  writeenabledflipflop32bit inst310 (
    .WriteEnable(1'b0), .Input(Input2), .ClockInput(inst278_out), .OutputRes(inst310_outputres));
  writeenabledflipflop32bit inst311 (
    .WriteEnable(1'b0), .Input(Input2), .ClockInput(inst279_out), .OutputRes(inst311_outputres));
  writeenabledflipflop32bit inst312 (
    .WriteEnable(1'b0), .Input(Input2), .ClockInput(inst280_out), .OutputRes(inst312_outputres));
  writeenabledflipflop32bit inst313 (
    .WriteEnable(1'b0), .Input(Input2), .ClockInput(inst281_out), .OutputRes(inst313_outputres));
  writeenabledflipflop32bit inst314 (
    .WriteEnable(1'b0), .Input(Input2), .ClockInput(inst282_out), .OutputRes(inst314_outputres));
  writeenabledflipflop32bit inst315 (
    .WriteEnable(1'b0), .Input(Input2), .ClockInput(inst283_out), .OutputRes(inst315_outputres));
  writeenabledflipflop32bit inst316 (
    .WriteEnable(1'b0), .Input(Input2), .ClockInput(inst284_out), .OutputRes(inst316_outputres));
  writeenabledflipflop32bit inst317 (
    .WriteEnable(1'b0), .Input(Input2), .ClockInput(inst285_out), .OutputRes(inst317_outputres));
  writeenabledflipflop32bit inst318 (
    .WriteEnable(1'b0), .Input(Input2), .ClockInput(inst286_out), .OutputRes(inst318_outputres));
  writeenabledflipflop32bit inst319 (
    .WriteEnable(1'b0), .Input(Input2), .ClockInput(inst287_out), .OutputRes(inst319_outputres));
  writeenabledflipflop32bit inst320 (
    .WriteEnable(1'b0), .Input(Input2), .ClockInput(inst288_out), .OutputRes(inst320_outputres));
  mux32_32bit inst (
    .Selector(Selector1), .Input00(inst145_outputres), .Input01(inst146_outputres),
    .Input02(inst147_outputres), .Input03(inst148_outputres), .Input04(inst149_outputres),
    .Input05(inst150_outputres), .Input06(inst151_outputres), .Input07(inst152_outputres),
    .Input08(inst153_outputres), .Input09(inst154_outputres), .Input10(inst155_outputres),
    .Input11(inst156_outputres), .Input12(inst157_outputres), .Input13(inst158_outputres),
    .Input14(inst159_outputres), .Input15(inst160_outputres), .Input16(inst161_outputres),
    .Input17(inst162_outputres), .Input18(inst163_outputres), .Input19(inst164_outputres),
    .Input20(inst165_outputres), .Input21(inst166_outputres), .Input22(inst167_outputres),
    .Input23(inst168_outputres), .Input24(inst169_outputres), .Input25(inst170_outputres),
    .Input26(inst171_outputres), .Input27(inst172_outputres), .Input28(inst173_outputres),
    .Input29(inst174_outputres), .Input30(inst175_outputres), .Input31(inst176_outputres),
    .ResultPin(ResultPin1));
  mux32_32bit inst321 (
    .Selector(Selector2), .Input00(inst289_outputres), .Input01(inst290_outputres),
    .Input02(inst291_outputres), .Input03(inst292_outputres), .Input04(inst293_outputres),
    .Input05(inst294_outputres), .Input06(inst295_outputres), .Input07(inst296_outputres),
    .Input08(inst297_outputres), .Input09(inst298_outputres), .Input10(inst299_outputres),
    .Input11(inst300_outputres), .Input12(inst301_outputres), .Input13(inst302_outputres),
    .Input14(inst303_outputres), .Input15(inst304_outputres), .Input16(inst305_outputres),
    .Input17(inst306_outputres), .Input18(inst307_outputres), .Input19(inst308_outputres),
    .Input20(inst309_outputres), .Input21(inst310_outputres), .Input22(inst311_outputres),
    .Input23(inst312_outputres), .Input24(inst313_outputres), .Input25(inst314_outputres),
    .Input26(inst315_outputres), .Input27(inst316_outputres), .Input28(inst317_outputres),
    .Input29(inst318_outputres), .Input30(inst319_outputres), .Input31(inst320_outputres),
    .ResultPin(ResultPin2));
endmodule
